# EAGLE design HOLTER AD (EAGLE 9.6.2)
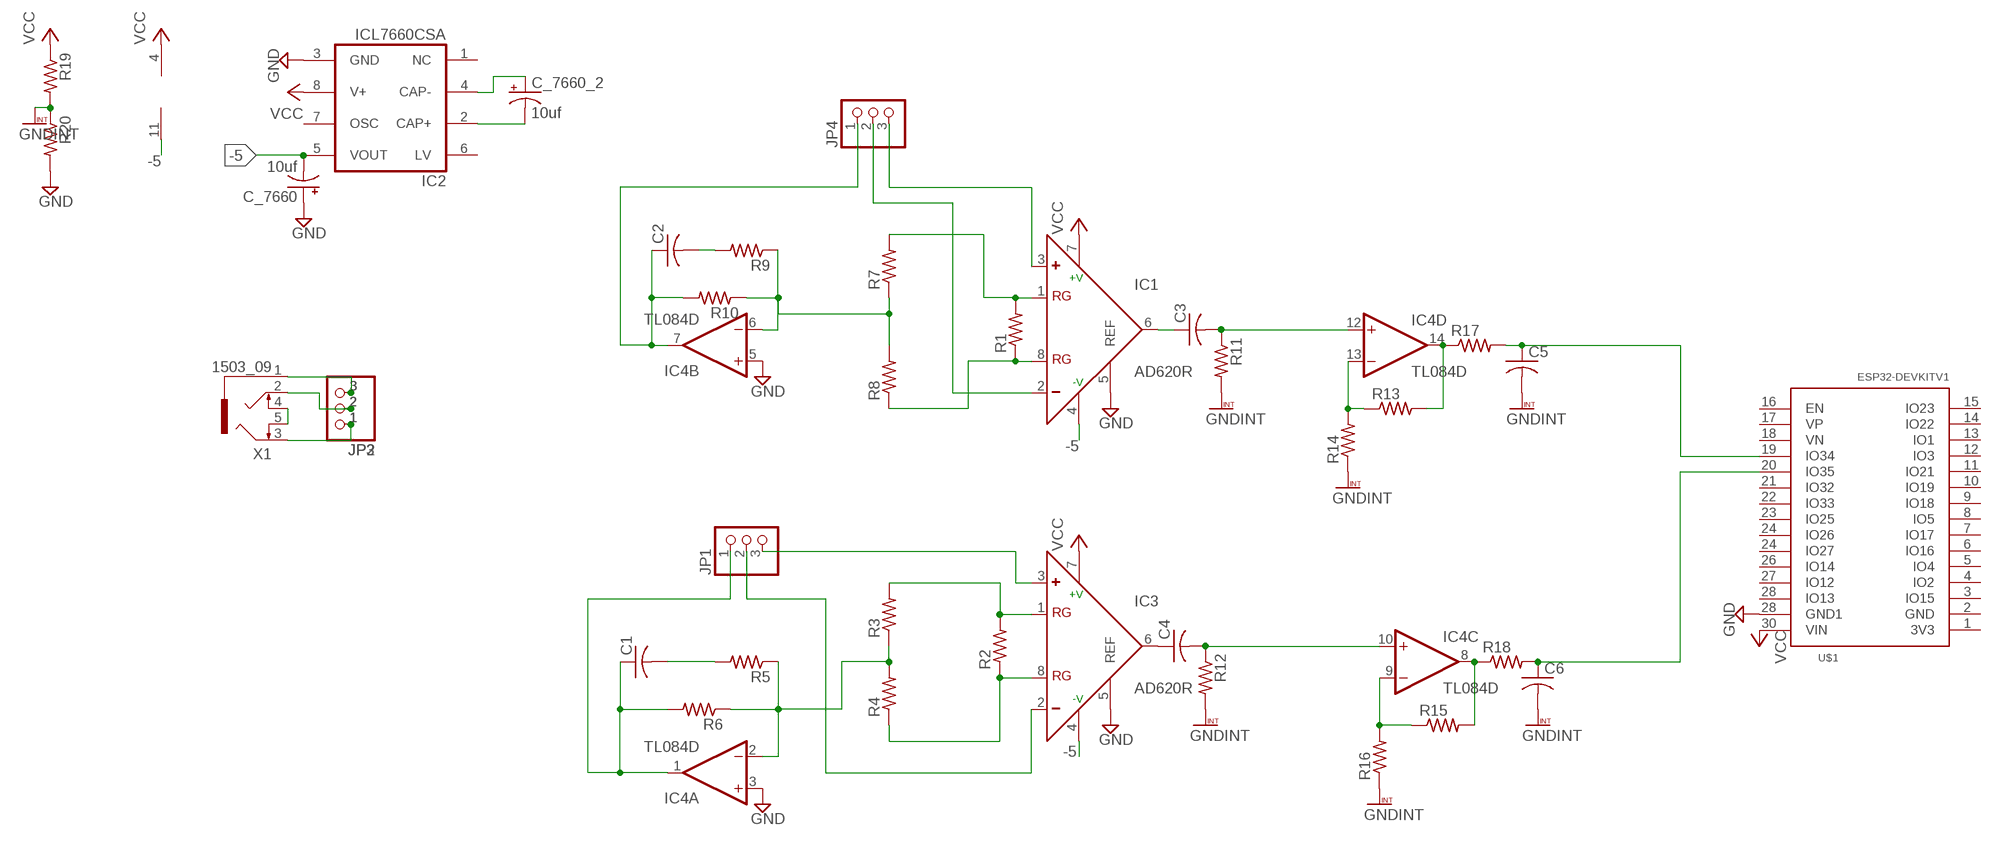
[diagram p0: schematic, sheet 1]

## Parts
C1  C-US050-030X075  [C050-030X075]
C2  C-US050-030X075  [C050-030X075]
C3  C-US050-030X075  [C050-030X075]
C4  C-US050-030X075  [C050-030X075]
C5  C-US050-030X075  [C050-030X075]
C6  C-US050-030X075  [C050-030X075]
C_7660  10uf  CPOL-USE2-5  [E2-5]
C_7660_2  10uf  CPOL-USE2-5  [E2-5]
IC1  AD620R  [SO8]
IC2  ICL7660CSA  [SO08]
IC3  AD620R  [SO8]
IC4  TL084D  [SO14]
JP1  PINHD-1X3  [1X03]
JP2  PINHD-1X3  [1X03]
JP3  PINHD-1X3  [1X03]
JP4  PINHD-1X3  [1X03]
R1  R-US_0207/10  [0207/10]
R2  R-US_0207/10  [0207/10]
R3  R-US_0207/10  [0207/10]
R4  R-US_0207/10  [0207/10]
R5  R-US_0207/10  [0207/10]
R6  R-US_0207/10  [0207/10]
R7  R-US_0207/10  [0207/10]
R8  R-US_0207/10  [0207/10]
R9  R-US_0207/10  [0207/10]
R10  R-US_0207/10  [0207/10]
R11  R-US_0207/10  [0207/10]
R12  R-US_0207/10  [0207/10]
R13  R-US_0207/10  [0207/10]
R14  R-US_0207/10  [0207/10]
R15  R-US_0207/10  [0207/10]
R16  R-US_0207/10  [0207/10]
R17  R-US_0207/10  [0207/10]
R18  R-US_0207/10  [0207/10]
R19  R-US_0207/10  [0207/10]
R20  R-US_0207/10  [0207/10]
U$1  ESP32DEVKITV1  [ESP32-DEVKITV1]
X1  1503_09  [1503_09]

## Nets
-5: C_7660.- IC1.4(-V) IC2.5(VOUT) IC3.4(-V) IC4.11(P:V-)
GND: C_7660.+ IC1.5(REF) IC2.3(GND) IC3.5(REF) IC4.3(A:+IN) IC4.5(B:+IN) R20.2 U$1.28(GND1)
GNDINT: C5.2 C6.2 R11.2 R12.2 R14.1 R16.1 R19.2 R20.1
N$1: X1.4 X1.5
N$2: C_7660_2.+ IC2.4(CAP-)
N$3: IC1.1(RG) R1.2 R7.2
N$4: IC1.8(RG) R1.1 R8.1
N$5: IC3.1(RG) R2.2 R3.2
N$6: C_7660_2.- IC2.2(CAP+)
N$7: IC3.8(RG) R2.1 R4.1
N$8: IC1.3(+) JP4.3
N$9: IC1.2(-) JP4.2
N$10: IC4.2(A:-IN) R3.1 R4.2 R5.1 R6.1
N$11: C2.2 R9.2
N$12: C1.2 R5.2
N$13: C1.1 IC4.1(A:OUT) JP1.1 R6.2
N$14: IC3.3(+) JP1.3
N$15: IC4.6(B:-IN) R7.1 R8.2 R9.1 R10.1
N$16: C2.1 IC4.7(B:OUT) JP4.1 R10.2
N$17: JP2.1 JP3.1 X1.3
N$18: JP2.2 JP3.2 X1.2
N$19: JP2.3 JP3.3 X1.1
N$20: C3.2 IC4.12(D:+IN) R11.1
N$21: C3.1 IC1.6(OUT)
N$22: IC3.2(-) JP1.2
N$23: C4.1 IC3.6(OUT)
N$24: C4.2 IC4.10(C:+IN) R12.1
N$25: IC4.13(D:-IN) R13.1 R14.2
N$26: IC4.14(D:OUT) R13.2 R17.1
N$27: IC4.9(C:-IN) R15.1 R16.2
N$28: IC4.8(C:OUT) R15.2 R18.1
N$29: C6.1 R18.2 U$1.20(IO35)
N$30: C5.1 R17.2 U$1.19(IO34)
VCC: IC1.7(+V) IC2.8(V+) IC3.7(+V) IC4.4(P:V+) R19.1 U$1.30(VIN)
Unconnected: IC2.1(NC) IC2.6(LV) IC2.7(OSC) U$1.1(3V3) U$1.2(GND) U$1.3(IO15) U$1.4(IO2) U$1.5(IO4) U$1.6(IO16) U$1.7(IO17) U$1.8(IO5) U$1.9(IO18) U$1.10(IO19) U$1.11(IO21) U$1.12(IO3) U$1.13(IO1) U$1.14(IO22) U$1.15(IO23) U$1.16(EN) U$1.17(VP) U$1.18(VN) U$1.21(IO32) U$1.22(IO33) U$1.23(IO25) U$1.24(IO26) U$1.24(IO27) U$1.26(IO14) U$1.27(IO12) U$1.28(IO13)

## Library data of the parts
C1-C6 = rcl:C-US: CAPACITOR, American symbol; SPICEPREFIX: C
C_7660 C_7660_2 = rcl:CPOL-US: POLARIZED CAPACITOR, American symbol; SPICEPREFIX: C
IC1 IC3 = analog-devices:AD620: Low Cost, Low Power, Instrumentation Amplifier Source: http://www.analog.com/UploadedFiles/Data_Sheets/37793330023930AD620_e.pdf; MPN: AD620AR; OC_FARNELL: 1464424; OC_NEWARK: 05F7109
IC2 = maxim:ICL7660CSA: VOLTAGE CONVERTER; MF: MAXIM; MPN: ICL7660CSA; OC_FARNELL: 9724710; OC_NEWARK: 34C3732
IC4 = linear:TL084: OP AMP
JP1-JP4 = pinhead:PINHD-1X3: PIN HEADER
R1-R20 = rcl:R-US_: RESISTOR, American symbol; SPICEPREFIX: R
U$1 = ESP32-DEVKITV1:ESP32DEVKITV1
X1 = con-lumberg:1503_09: Jack connectors according to JISC 6560, 3.5 mm Klinkeneinbaukupplung nach JISC 6560, 3,5 mm, 3-polig/ stereo, abgewinkelte Ausführung, mit 2 Öffnern und Lötaugen, für Leiterplatten Rückseitenmontage Source: http://www.lumberg.com/Produkte/PDFs/1503_09.pdf; OC_FARNELL: 1243244; OC_NEWARK: unknown

## Board
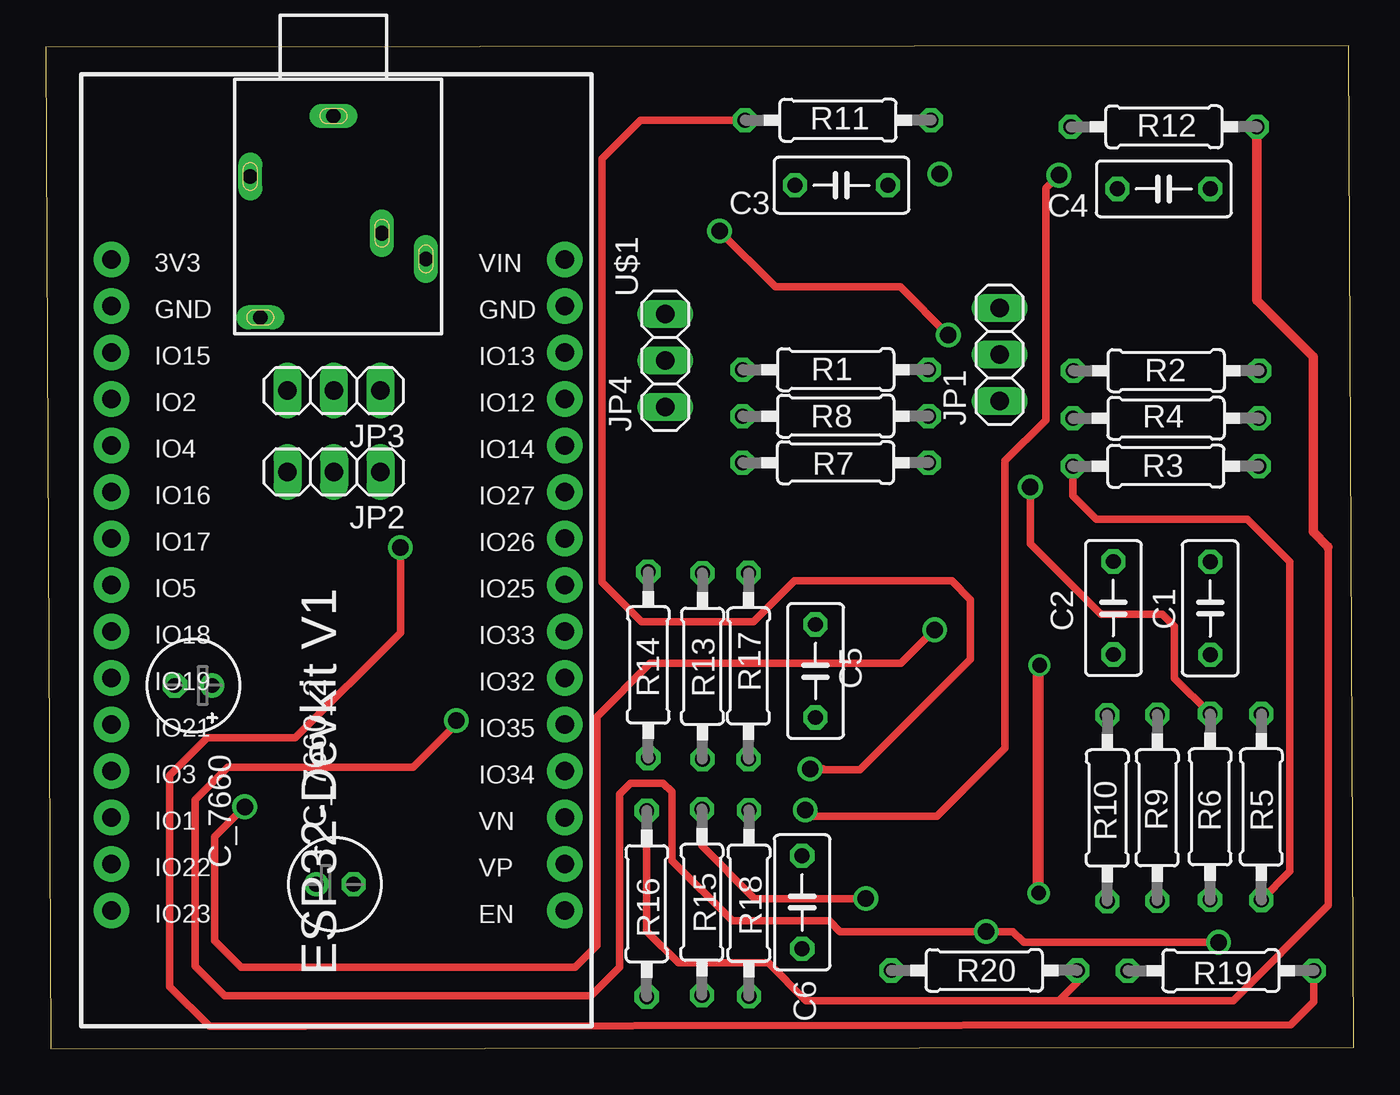
[diagram p1: board, top side]
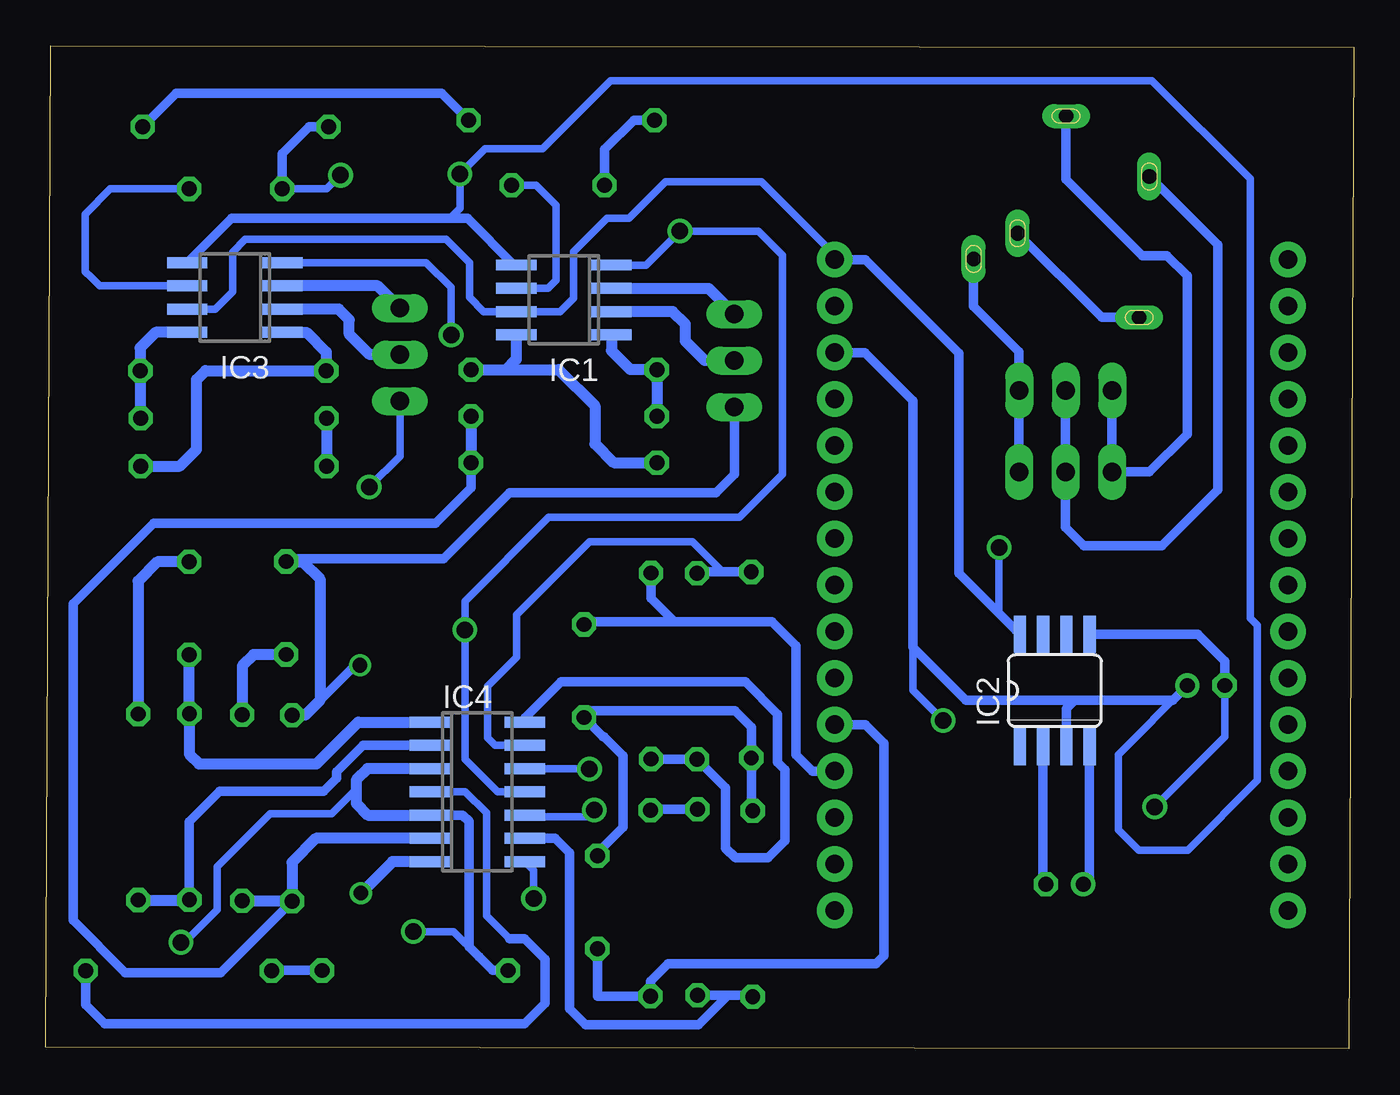
[diagram p2: board, bottom side, seen from below]

Size 71.47 x 54.79 mm. Coordinates in mm from the lower left corner, seen from the top.
Outline: 0.28,0 71.47,0.09 71.19,54.79 0,54.7 0.28,0
Copper layers (1*16): Top 0.035mm / dielectric 1.5mm / Bottom 0.035mm
Design rules "default *": minimum track width 6mil, minimum drill 0.35mm, track to track 0.5mm, track to pad 0.5mm, pad to pad 0.5mm, via to via 0.5mm, smd to smd 0.5mm, copper to edge 40mil, drill to drill 6mil, minimum pad ring 10mil, minimum via ring 8mil, stop-mask expansion 4mil, vias tented up to drill 0mil, thermal gap 10mil

### Footprints (pad centres in the part's own frame; a part is rotated, then mirrored left to right if it is on the bottom)
C050-030X075 = drill 0.813 octagon: 1 -2.54,0; 2 2.54,0
E2-5 = drill 0.813 pad 1.27: + -1.016,0 | drill 0.813 pad 1.27 octagon: - 1.016,0
SO8 = smd 0.6 x 2.2: 1 -1.905,-2.6; 2 -0.635,-2.6; 3 0.635,-2.6; 4 1.905,-2.6; 5 1.905,2.6; 6 0.635,2.6; 7 -0.635,2.6; 8 -1.905,2.6
SO08 = smd 0.66 x 2.032: 1 -1.905,-3.073; 2 -0.635,-3.073; 3 0.635,-3.073; 4 1.905,-3.073; 5 1.905,3.073; 6 0.635,3.073; 7 -0.635,3.073; 8 -1.905,3.073
SO14 = smd 0.6 x 2.2: 1 -3.81,-2.6; 2 -2.54,-2.6; 3 -1.27,-2.6; 4 0,-2.6; 5 1.27,-2.6; 6 2.54,-2.6; 7 3.81,-2.6; 8 3.81,2.6; 9 2.54,2.6; 10 1.27,2.6; 11 0,2.6; 12 -1.27,2.6; 13 -2.54,2.6; 14 -3.81,2.6
1X03 = drill 1.016 long: 1 -2.54,0; 2 0,0; 3 2.54,0
0207/10 = drill 0.813 octagon: 1 -5.08,0; 2 5.08,0
ESP32-DEVKITV1 = drill 1 pad 1.93: 1 -22.87,-13.54; 2 -20.33,-13.54; 3 -17.79,-13.54; 4 -15.25,-13.54; 5 -12.71,-13.54; 6 -10.17,-13.54; 7 -7.63,-13.54; 8 -5.09,-13.54; 9 -2.55,-13.54; 10 -0.01,-13.54; 11 2.53,-13.54; 12 5.07,-13.54; 13 7.61,-13.54; 14 10.15,-13.54; 15 12.69,-13.54; 16 12.69,11.23; 17 10.15,11.23; 18 7.61,11.23; 19 5.07,11.23; 20 2.53,11.23; 21 -0.01,11.23; 22 -2.55,11.23; 23 -5.09,11.23; 24 -7.63,11.23; 25 -10.17,11.23; 26 -12.71,11.23; 27 -15.25,11.23; 28 -17.79,11.23; 29 -20.33,11.23; 30 -22.87,11.23
1503_09 = drill 0.8 pad 1.2 long: 1 0,-2.1; 2 -4.55,-5.4; 3 5.05,-9.9; 4 -4,-13.1; 5 2.65,-8.5

### Placement (x,y rotation side)
C1  63.63,24.06 90 top
C2  58.33,24.08 270 top
C3  43.48,47.17 180 top
C4  61.09,46.97 180 top
C5  42.06,20.64 270 top
C6  41.33,8 90 top
C_7660  8.07,19.85 180 top
C_7660_2  15.8,8.99 0 top
IC1  43.16,40.91 90 bottom
IC2  16.34,19.57 0 bottom
IC3  61.14,41.04 90 bottom
IC4  47.89,14.04 270 bottom
JP1  52.12,37.92 90 top
JP2  15.75,31.51 180 top
JP3  15.74,35.95 180 top
JP4  33.84,37.59 90 top
R1  43.16,37.1 180 top
R2  61.22,37.04 180 top
R3  61.2,31.83 0 top
R4  61.21,34.44 180 top
R5  66.42,13.21 90 top
R6  63.62,13.22 90 top
R7  43.16,34.56 180 top
R8  43.16,32.02 0 top
R9  60.73,13.17 90 top
R10  58,13.15 90 top
R11  43.29,50.73 0 top
R12  61.1,50.36 0 top
R13  35.88,20.9 270 top
R14  32.92,20.97 90 top
R15  35.85,8.01 90 top
R16  32.84,7.93 270 top
R17  38.4,20.91 90 top
R18  38.42,7.96 270 top
R19  64.21,4.27 180 top
R20  51.28,4.28 180 top
U$1  17.13,20.24 270 top
X1  15.72,53.05 0 top

### Tracks (layer width: path | path; a pad name or v marks a point on that pad's centre or on a via)
-5  (via drill 0.9)
  Top 0.406: v10.87,13.22 9.24,11.59 9.24,5.91 10.69,4.46 28.92,4.46 30.12,5.66 30.12,18.15 33.03,21.06 46.74,21.06 v48.57,22.89 | v49.32,38.99 46.69,41.62 39.87,41.62 v36.82,44.67
  Bottom 0.406: IC4.11 46.79,14.04 48.57,15.82 v48.57,22.89 48.57,24.45 43.99,29.03 33.57,29.03 31.21,31.39 31.21,43.35 32.53,44.67 v36.82,44.67 38.68,42.81 IC1.4 | v10.87,13.22 7.05,17.04 C_7660.- | IC3.4 50.67,42.95 49.32,41.59 v49.32,38.99
  Bottom 0.508: IC2.5 8.51,22.64 7.05,21.18 C_7660.- | IC4.11 45.27,14.06
GND  (via drill 0.9)
  Top 0.406: v64.09,5.82 53.44,5.82 52.85,6.41 v51.38,6.41 43.4,6.41 42.82,6.99 37.52,6.99 34.23,10.28 34.23,14.03 33.74,14.52 31.96,14.52 31.36,13.92 31.36,4.46 29.8,2.9 9.77,2.9 8.17,4.5 8.17,13.62 9.93,15.38 20.07,15.38 22.44,17.75 v22.44,17.94
  Bottom 0.406: 49.39,45.36 48.84,45.91 v48.84,47.79 47.46,49.17 44.33,49.17 40.61,52.89 11.02,52.89 5.66,47.53 5.66,23.53 5.26,23.13 5.26,14.66 9.07,10.85 11.74,10.85 12.87,11.98 12.87,16.07 C_7660.+ | 54.51,14.18 55.86,12.83 59.21,12.83 62.09,9.95 62.09,7.61 63.89,5.82 v64.09,5.82 | v51.38,6.41 49.18,6.41 47.8,5.03 | v22.44,17.94 24.09,19.59 24.09,22.45
  Bottom 0.508: IC3.5 61.33,45.36 49.39,45.36 48.42,45.36 45.87,42.81 IC1.5 | IC4.5 48.7,12.77 48.35,12.42 48.35,5.58 47.8,5.03 47.05,4.28 R20.2 | IC2.3 15.71,18.59 15.25,19.04 | 15.25,19.04 9.9,19.04 C_7660.+ | 15.25,19.04 21.2,19.04 24.09,21.93 24.09,22.45 24.09,35.41 26.71,38.03 U$1.28
  Bottom 0.61: IC4.3 53.89,15.31 54.51,14.69 54.51,14.18 54.51,13.41 53.87,12.77 IC4.5
GNDINT
  Top 0.406: R16.1 32.84,6.43 34.58,4.69 39.49,4.69 41.54,2.64 55.37,2.64 | 55.37,2.64 56.36,3.63 R20.1 | 55.37,2.64 64.88,2.64 70.08,7.84 70.08,27.41
  Top 0.508: R12.2 66.18,40.88 69.25,37.81 69.25,28.24 70.06,27.43 70.06,27.41
  Bottom 0.508: R16.1 32.92,13.09 R14.1 32.92,17.58 33.82,18.48 41.68,18.48 C5.2 41.01,17.05 40.97,17.05 39.93,16.01 39.93,12.1 41.33,10.7 C6.2 41.08,10.79 | R11.2 49.85,52.21 64.33,52.21 R12.2 | R19.2 R20.1
N$1
  Bottom 0.508: X1.5 13.77,39.95 X1.4
N$2
  Bottom 0.508: IC2.4 14.43,9.34 C_7660_2.+
N$3
  Bottom 0.61: IC1.1 40.56,38.14 39.52,37.1 R1.2 R7.2
N$4
  Bottom 0.61: IC1.8 45.76,37.66 46.32,37.1 R1.1 43.44,37.1 41.47,35.13 41.47,33.05 40.44,32.02 R8.1
N$5
  Bottom 0.61: IC3.1 57.22,39.13 56.14,38.06 R2.2 62.74,37.04 63.23,36.55 63.23,32.74 64.14,31.83 R3.2
N$6
  Bottom 0.508: IC2.2 16.97,9.15 C_7660_2.-
N$7
  Bottom 0.61: IC3.8 65.47,39.13 66.31,38.29 R2.1 R4.1
N$8
  Bottom 0.61: IC1.3 35.25,41.55 JP4.3
N$9
  Bottom 0.61: JP4.2 35.45,37.59 36.52,38.66 36.52,39.58 37.22,40.27 IC1.2
N$10
  Top 0.406: R3.1 56.12,30.22 57.4,28.94 65.65,28.94 67.98,26.61 67.98,9.69 R5.1
  Bottom 0.508: IC4.2 54.12,16.58 55.57,15.13 55.57,14.78 56.29,14.06 61.97,14.06 63.63,12.4 R6.1
  Bottom 0.61: R4.2 R3.1 | R5.1 R6.1
N$11
  Bottom 0.61: C2.2 60.11,21.54 60.73,20.92 R9.2
N$12
  Bottom 0.61: C1.2 65.37,26.6 66.42,25.55 R5.2
N$13  (via drill 0.9)
  Top 0.406: v53.8,30.69 53.8,27.59 57.66,23.73 61.02,23.73 61.67,23.08 61.67,20.25 R6.2
  Bottom 0.406: JP1.1 52.12,32.37 v53.8,30.69
  Bottom 0.61: C1.1 R6.2 63.62,16.1 63.09,15.57 56.68,15.57 54.4,17.85 IC4.1
N$14
  Bottom 0.61: JP1.3 53.34,41.67 IC3.3
N$15
  Bottom 0.508: R10.1 61.91,4.16 67.12,4.16 69.98,7.02 69.98,24.31 65.57,28.72 50.18,28.72 48.24,30.66 R8.2
  Bottom 0.61: R7.1 R8.2 | R9.1 58.02,8.09 | 58.02,8.09 R10.1 | IC4.6 56.71,11.5 58.02,10.19 58.02,8.09
N$16  (via drill 0.8)
  Top 0.61: v54.25,8.51 54.25,20.9 v54.3,20.95
  Bottom 0.508: v54.3,20.95 54.57,20.95 56.48,19.04 | JP4.1 33.84,31.39 34.86,30.37 46.13,30.37 49.74,26.76 58.19,26.76 C2.1
  Bottom 0.61: C2.1 57.43,26.62 56.48,25.67 56.48,19.04 57.29,18.23 R10.2 | IC4.7 52.53,10.23 v54.25,8.51
N$17
  Bottom 0.508: JP2.1 18.29,35.73 JP3.1 | JP3.1 | X1.3 20.77,40.57 18.29,38.09 JP3.1
N$18
  Bottom 0.508: JP3.2 JP2.2 15.75,28.48 14.75,27.48 10.48,27.48 7.43,30.53 7.43,43.91 X1.2
N$19
  Bottom 0.508: JP3.3 JP2.3 11.16,31.51 9.1,33.57 9.1,42.23 10.2,43.33 11.55,43.33 15.72,47.5 X1.1
N$20  (via drill 0.9)
  Top 0.406: R11.1 32.5,50.73 30.4,48.63 30.4,25.49 32.56,23.33 38.68,23.33 40.91,25.56 49.5,25.56 50.52,24.54 50.52,21.28 44.48,15.24 42.41,15.24 42.46,15.29 v41.76,15.29
  Bottom 0.406: IC4.12 41.78,15.31 v41.76,15.29
  Bottom 0.508: R11.1 39.34,50.73 40.94,49.13 C3.2
N$21
  Bottom 0.406: C3.1 44.69,47.17 43.59,46.07 43.59,41.99 44.03,41.55 IC1.6
N$22
  Bottom 0.61: JP1.2 53.77,37.92 54.88,39.03 54.88,39.82 55.47,40.41 IC3.2
N$23
  Bottom 0.406: C4.1 67.94,46.97 69.31,45.6 69.31,42.45 69,42.13 68.53,41.67 IC3.6
N$24  (via drill 0.9)
  Top 0.406: v41.5,13.04 41.83,12.71 48.7,12.71 52.42,16.43 52.42,32.12 54.64,34.34 54.64,47 v55.36,47.72
  Bottom 0.406: C4.2 56.11,46.97 v55.36,47.72 | IC4.10 45.21,12.69 41.85,12.69 v41.5,13.04
  Bottom 0.508: R12.1 57.09,50.36 58.55,48.9 C4.2
N$25
  Bottom 0.406: IC4.13 46.91,16.58 47.33,17 47.33,19.81 45.75,21.39 45.75,23.71 41.77,27.69 36.12,27.69 34.48,26.05
  Bottom 0.508: R14.2 34.48,26.05 35.81,26.05 R13.1
N$26
  Bottom 0.508: R17.1 R13.2 34.32,14.26 34.32,10.97 33.78,10.43 32.02,10.43 31.07,11.37 31.07,15.23 31.48,15.64 31.48,18.29 33.24,20.05 43.32,20.05 45.29,18.08 IC4.14
N$27
  Bottom 0.508: R15.1 34.19,2.93 | 34.19,2.93 32.92,2.93 R16.2 | 34.19,2.93 35.8,1.32 37.83,1.32 41.98,1.32 42.86,2.2 42.86,10.71 43.65,11.5 IC4.9
N$28  (via drill 0.9)
  Top 0.406: v44.81,8.21 38.73,8.21 35.85,11.09 R15.2
  Bottom 0.406: IC4.8 44.81,9.75 v44.81,8.21
  Bottom 0.508: R15.2 38.37,13.09 R18.1
N$29
  Bottom 0.508: C6.1 41.33,2.88 R18.2 38.42,3.69 37.47,4.64 26.12,4.64 25.67,5.09 25.67,16.7 26.68,17.71 U$1.20
N$30
  Bottom 0.508: U$1.19 29.58,15.17 30.47,16.06 30.47,22.02 31.79,23.34 37.12,23.34 | 37.12,23.34 38.4,24.62 R17.2 | C5.1 41.9,23.34 37.12,23.34
VCC  (via drill 0.9)
  Top 0.406: R19.1 69.29,2.58 68.02,1.3 14.16,1.24 8.94,1.24 6.78,3.4 6.78,14.95 8.81,16.98 13.63,16.98 19.38,22.73 v19.38,27.38
  Bottom 0.406: IC4.4 48.54,14.04 47.39,12.89 47.39,7.26 46.14,6.01 | 28.06,43.11 28.08,43.09 32.36,47.36 37.61,47.36 39.6,45.37 40.79,45.37 42.63,43.53 42.63,41.01 43.37,40.27 IC1.7 47.53,40.27 48.32,41.06 48.32,42.94 49.59,44.21 60.57,44.21 61.27,43.51 61.27,41.36 62.23,40.41 IC3.7 | v19.38,27.38 19.38,23.78 18.47,22.87
  Bottom 0.508: U$1.30 28.06,43.11 26.68,43.11 21.57,38 21.57,25.97 18.47,22.87 IC2.8 | 46.14,6.01 45.3,6.01 44.19,4.9 44.19,2.48 45.3,1.37 68.24,1.37 69.29,2.42 R19.1